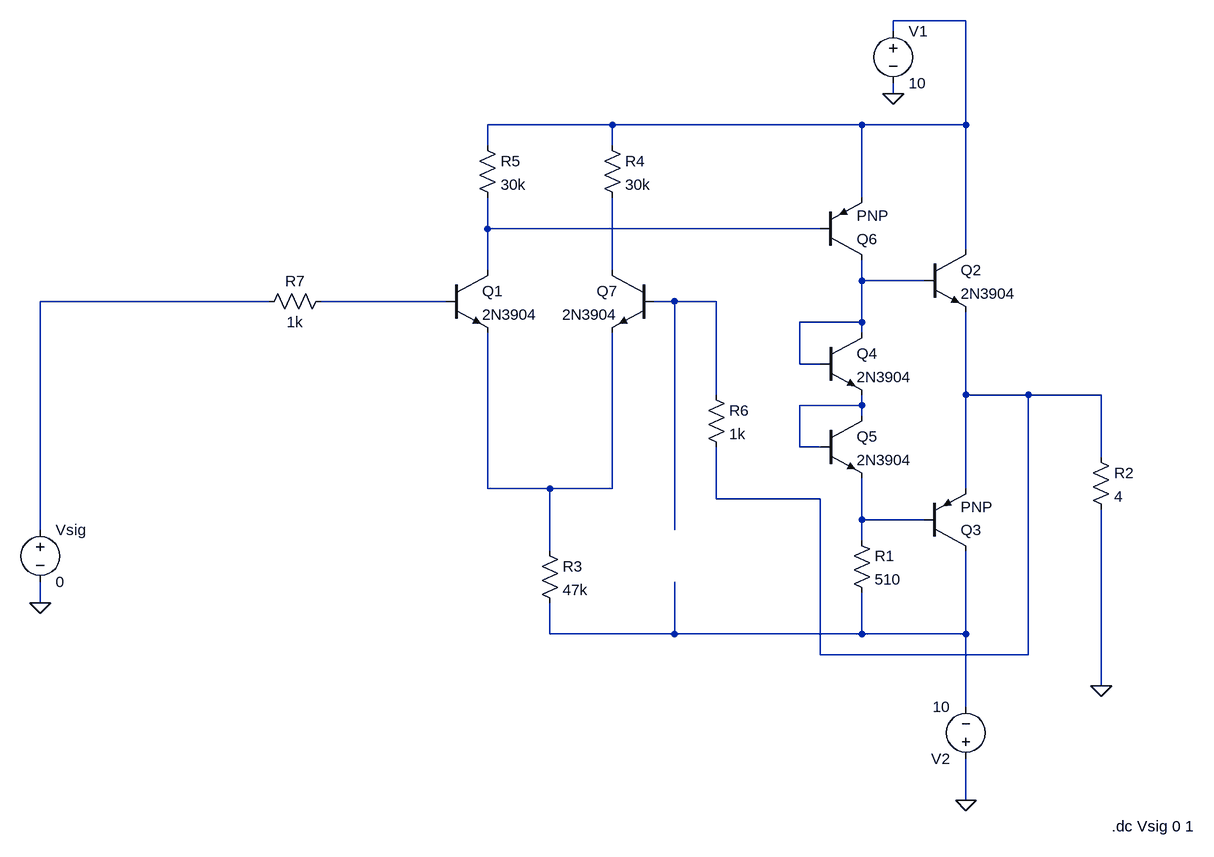
[diagram p0: schematic output_stage.asc]
output_stage.asc, the LTspice schematic file:
Version 4
SHEET 1 1272 864
WIRE 672 -512 560 -512
WIRE 560 -496 560 -512
WIRE 560 -400 560 -416
WIRE 128 -352 -64 -352
WIRE 512 -352 128 -352
WIRE 672 -352 672 -512
WIRE 672 -352 512 -352
WIRE -64 -320 -64 -352
WIRE 128 -320 128 -352
WIRE 512 -240 512 -352
WIRE -64 -192 -64 -240
WIRE 448 -192 -64 -192
WIRE 672 -160 672 -352
WIRE -64 -128 -64 -192
WIRE 128 -128 128 -240
WIRE 512 -112 512 -144
WIRE 608 -112 512 -112
WIRE -400 -80 -752 -80
WIRE -128 -80 -320 -80
WIRE 224 -80 192 -80
WIRE 288 -80 224 -80
WIRE 512 -48 512 -112
WIRE 512 -48 416 -48
WIRE 512 -32 512 -48
WIRE 416 16 416 -48
WIRE 448 16 416 16
WIRE 288 64 288 -80
WIRE 672 64 672 -64
WIRE 768 64 672 64
WIRE 880 64 768 64
WIRE 512 80 512 64
WIRE 512 80 416 80
WIRE 512 96 512 80
WIRE 416 144 416 80
WIRE 448 144 416 144
WIRE 880 160 880 64
WIRE -64 208 -64 -32
WIRE 32 208 -64 208
WIRE 128 208 128 -32
WIRE 128 208 32 208
WIRE 672 208 672 64
WIRE 288 224 288 144
WIRE 448 224 288 224
WIRE 512 256 512 192
WIRE 608 256 512 256
WIRE -752 272 -752 -80
WIRE 224 272 224 -80
WIRE 512 288 512 256
WIRE 32 304 32 208
WIRE -752 384 -752 352
WIRE 32 432 32 384
WIRE 224 432 224 352
WIRE 224 432 32 432
WIRE 512 432 512 368
WIRE 512 432 224 432
WIRE 672 432 672 304
WIRE 672 432 512 432
WIRE 448 464 448 224
WIRE 768 464 768 64
WIRE 768 464 448 464
WIRE 880 512 880 240
WIRE 672 544 672 432
WIRE 672 688 672 624
FLAG 560 -400 0
FLAG 672 688 0
FLAG 880 512 0
FLAG -752 384 0
SYMBOL voltage 560 -512 R0
WINDOW 123 0 0 Left 2
WINDOW 39 0 0 Left 2
SYMATTR InstName V1
SYMATTR Value 10
SYMBOL res 496 272 R0
SYMATTR InstName R1
SYMATTR Value 510
SYMBOL npn 608 -160 R0
SYMATTR InstName Q2
SYMATTR Value 2N3904
SYMBOL res 864 144 R0
SYMATTR InstName R2
SYMATTR Value 4
SYMBOL pnp 608 304 M180
SYMATTR InstName Q3
SYMBOL npn 448 -32 R0
SYMATTR InstName Q4
SYMATTR Value 2N3904
SYMBOL npn 448 96 R0
SYMATTR InstName Q5
SYMATTR Value 2N3904
SYMBOL pnp 448 -144 M180
SYMATTR InstName Q6
SYMBOL voltage 672 640 R180
WINDOW 123 0 0 Left 2
WINDOW 39 0 0 Left 2
SYMATTR InstName V2
SYMATTR Value 10
SYMBOL npn -128 -128 R0
SYMATTR InstName Q1
SYMATTR Value 2N3904
SYMBOL res 16 288 R0
SYMATTR InstName R3
SYMATTR Value 47k
SYMBOL voltage -752 256 R0
WINDOW 123 0 0 Left 2
WINDOW 39 0 0 Left 2
SYMATTR InstName Vsig
SYMATTR Value 0
SYMBOL npn 192 -128 M0
SYMATTR InstName Q7
SYMATTR Value 2N3904
SYMBOL res 112 -336 R0
SYMATTR InstName R4
SYMATTR Value 30k
SYMBOL res 272 48 R0
SYMATTR InstName R6
SYMATTR Value 1k
SYMBOL res -416 -64 R270
WINDOW 0 32 56 VTop 2
WINDOW 3 0 56 VBottom 2
SYMATTR InstName R7
SYMATTR Value 1k
SYMBOL res -80 -336 R0
SYMATTR InstName R5
SYMATTR Value 30k
TEXT 896 728 Left 2 !.dc Vsig 0 1

The netlist it stands for:
* output_stage.asc
V1 N001 0 10
R1 N011 N012 510
Q2 N001 N004 N008 0 2N3904
R2 N008 0 4
Q3 N012 N011 N008 0 PNP
Q4 N004 N004 N009 0 2N3904
Q5 N009 N009 N011 0 2N3904
Q6 N004 N002 N001 0 PNP
V2 0 N012 10
Q1 N002 N006 N010 0 2N3904
R3 N010 N012 47k
Vsig N005 0 0
Q7 N003 N007 N010 0 2N3904
R4 N001 N003 30k
R6 N007 N008 1k
R7 N005 N006 1k
R5 N001 N002 30k
.model NPN NPN
.model PNP PNP
.lib standard.bjt
.dc Vsig 0 1
.backanno
.end